# EAGLE design LPC11U24Gadget1 (EAGLE 5.10)
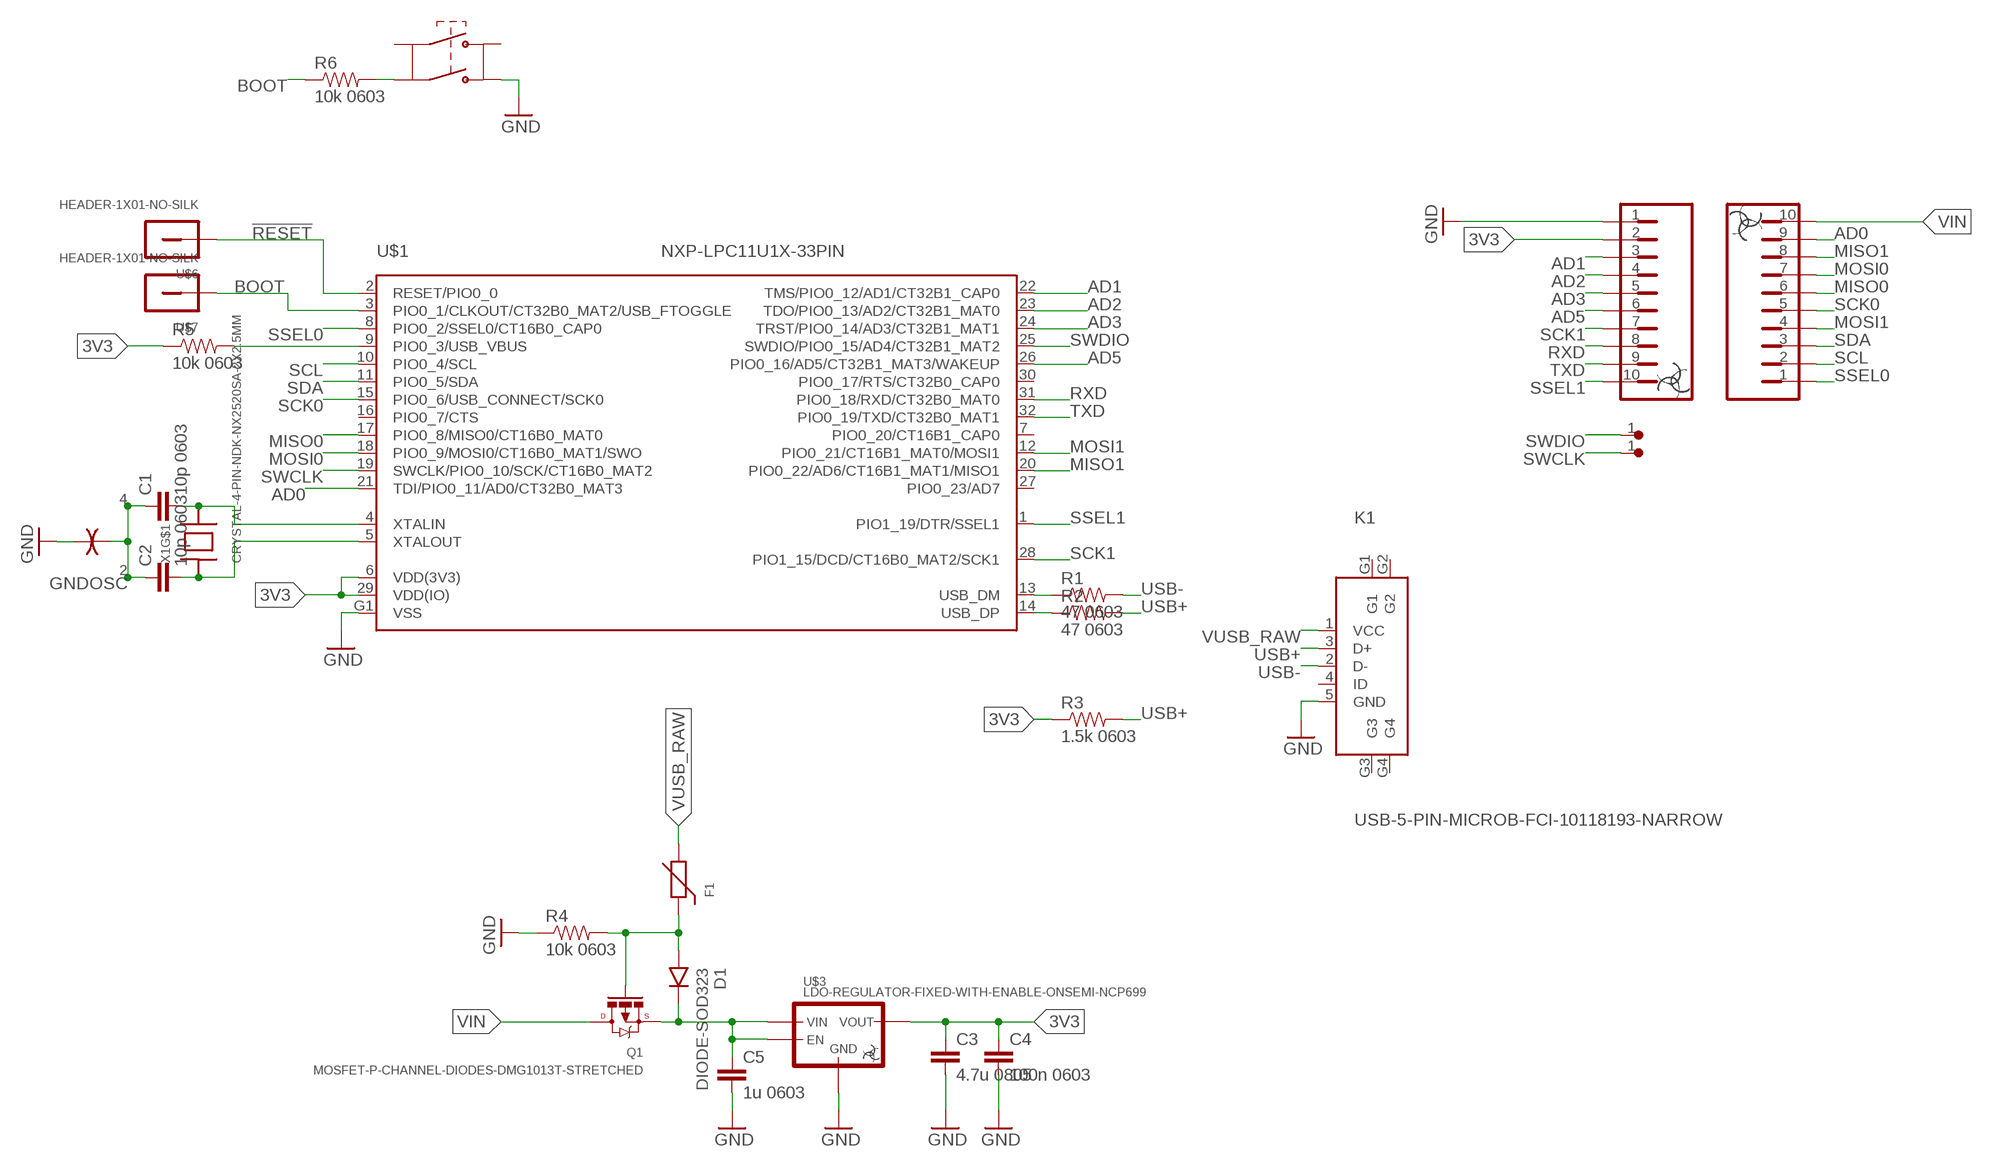
[diagram p0: schematic, sheet 1]

## Parts
C1  10p 0603  CAP-0402-MIN  [0402-MIN]
C2  10p 0603  CAP-0402-MIN  [0402-MIN]
C3  4.7u 0805  CAP-0805  [0805]
C4  100n 0603  CAP-0402-MIN  [0402-MIN]
C5  1u 0603  CAP-0402-MIN  [0402-MIN]
D1  DIODE-SOD323  [SOD323]
F1  PTC-0805-WIDE  [0805-WIDE]
K1  USB-5-PIN-MICROB-FCI-10118193-NARROW  [USB-MICROB-FCI-10118193-NARROW]
K2  HEADER-1X10-NO-SILK  [HEADER-1X10-NO-SILK-CHUNKY]
K3  HEADER-1X10-NO-SILK  [HEADER-1X10-NO-SILK-CHUNKY]
Q1  MOSFET-P-CHANNEL-DIODES-DMG1013T-STRETCHED  [SC-75A-STRETCHED]
R1  47 0603  RESISTOR-0402-MIN  [0402-MIN]
R2  47 0603  RESISTOR-0402-MIN  [0402-MIN]
R3  1.5k 0603  RESISTOR-0402-MIN  [0402-MIN]
R4  10k 0603  RESISTOR-0402-MIN  [0402-MIN]
R5  10k 0603  RESISTOR-0402-MIN  [0402-MIN]
R6  10k 0603  RESISTOR-0402-MIN  [0402-MIN]
SW1  SWITCH-SPST-4-PIN-3.5X3.5MM  [BUTTON-3.5X3.5MM]
U1  GND-ISOLATOR-0.008"  [GND-ISOLATOR-0.008"]
U$1  NXP-LPC11U1X-33PIN  [HVQFN33-5X5MM]
U$3  LDO-REGULATOR-FIXED-WITH-ENABLE-ONSEMI-NCP699  [SOT23-5]
U$4  TEST-POINT-0.75MM  [TEST-POINT-0.75MM]
U$5  TEST-POINT-0.75MM  [TEST-POINT-0.75MM]
U$6  HEADER-1X01-NO-SILK  [HEADER-1X01-NO-SILK]
U$7  HEADER-1X01-NO-SILK  [HEADER-1X01-NO-SILK]
X1  CRYSTAL-4-PIN-NDK-NX2520SA-2X2.5MM  [CRYSTAL-NDK-NX2025SA-2X2.5MM]

## Nets
3V3: C3.2 C4.2 K2.2 R3.1 R5.1 U$1.6(VDD(3V3)) U$1.29(VDD(IO)) U$3.5(VOUT)
!RESET: U$1.2(RESET/PIO0_0) U$6.1
AD0: K3.9 U$1.21(TDI/PIO0_11/AD0/CT32B0_MAT3)
AD1: K2.3 U$1.22(TMS/PIO0_12/AD1/CT32B1_CAP0)
AD2: K2.4 U$1.23(TDO/PIO0_13/AD2/CT32B1_MAT0)
AD3: K2.5 U$1.24(TRST/PIO0_14/AD3/CT32B1_MAT1)
AD5: K2.6 U$1.26(PIO0_16/AD5/CT32B1_MAT3/WAKEUP)
BOOT: R6.1 U$1.3(PIO0_1/CLKOUT/CT32B0_MAT2/USB_FTOGGLE) U$7.1
D+: R2.1 U$1.14(USB_DP)
D-: R1.1 U$1.13(USB_DM)
GND: C3.1 C4.1 C5.1 K1.5(GND) K2.1 R4.1 SW1.3(B2) U1.1(A) U$1.G1(VSS) U$3.2(GND)
GNDOSC: C1.2 C2.2 U1.2(B) X1.2 X1.4
MISO0: K3.6 U$1.17(PIO0_8/MISO0/CT16B0_MAT0)
MISO1: K3.8 U$1.20(PIO0_22/AD6/CT16B1_MAT1/MISO1)
MOSI0: K3.7 U$1.18(PIO0_9/MOSI0/CT16B0_MAT1/SWO)
MOSI1: K3.4 U$1.12(PIO0_21/CT16B1_MAT0/MOSI1)
N$1: C1.1 U$1.4(XTALIN) X1.3
N$2: R6.2 SW1.4(A2)
N$3: C2.1 U$1.5(XTALOUT) X1.1
RXD: K2.8 U$1.31(PIO0_18/RXD/CT32B0_MAT0)
SCK0: K3.5 U$1.15(PIO0_6/USB_CONNECT/SCK0)
SCK1: K2.7 U$1.28(PIO1_15/DCD/CT16B0_MAT2/SCK1)
SCL: K3.2 U$1.10(PIO0_4/SCL)
SDA: K3.3 U$1.11(PIO0_5/SDA)
SSEL0: K3.1 U$1.8(PIO0_2/SSEL0/CT16B0_CAP0)
SSEL1: K2.10 U$1.1(PIO1_19/DTR/SSEL1)
SWCLK: U$1.19(SWCLK/PIO0_10/SCK/CT16B0_MAT2) U$5.1
SWDIO: U$1.25(SWDIO/PIO0_15/AD4/CT32B1_MAT2) U$4.1
TXD: K2.9 U$1.32(PIO0_19/TXD/CT32B0_MAT1)
USB+: K1.3(D+) R2.2 R3.2
USB-: K1.2(D-) R1.2
USB_BOOT: R5.2 U$1.9(PIO0_3/USB_VBUS)
VIN: K3.10 Q1.3(DRAIN)
VSHARE: C5.2 D1.K Q1.2(SOURCE) U$3.1(VIN) U$3.3(EN)
VUSB_FUSED: D1.A F1.2 Q1.1(GATE) R4.2
VUSB_RAW: F1.1 K1.1(VCC)
Unconnected: K1.4(ID) K1.G1 K1.G2 K1.G3 K1.G4 SW1.1(A1) SW1.2(B1) U$1.7(PIO0_20/CT16B1_CAP0) U$1.16(PIO0_7/CTS) U$1.27(PIO0_23/AD7) U$1.30(PIO0_17/RTS/CT32B0_CAP0)

## Library data of the parts
C1-C5 = Outbreak:CAP
D1 = Outbreak:DIODE
F1 = Outbreak:PTC
K1 = Outbreak:USB-5-PIN
K2 K3 = Outbreak:HEADER-1X10-NO-SILK
Q1 = Outbreak:MOSFET-P-CHANNEL
R1-R6 = Outbreak:RESISTOR: Resistor Basic schematic elements and footprints for 0603, 1206, and PTH resistors.
SW1 = Outbreak:SWITCH-SPST-4-PIN
U1 = Outbreak:GND-ISOLATOR
U$1 = Outbreak:NXP-LPC11U1X-33PIN
U$3 = Outbreak:LDO-REGULATOR-FIXED-WITH-ENABLE: Low Drop-Out (LDO) Volt Regulator with enable pin (active at logic high.)
U$4 U$5 = Outbreak:TEST-POINT
U$6 U$7 = Outbreak:HEADER-1X01
X1 = Outbreak:CRYSTAL-4-PIN

## Board
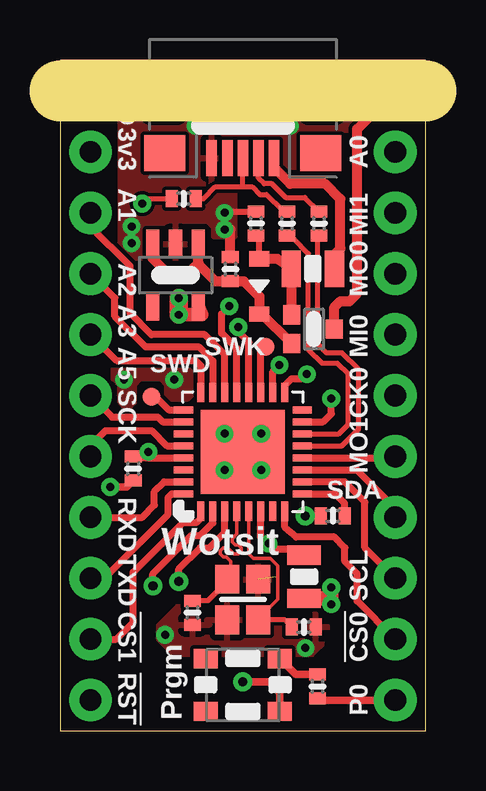
[diagram p1: board, top side]
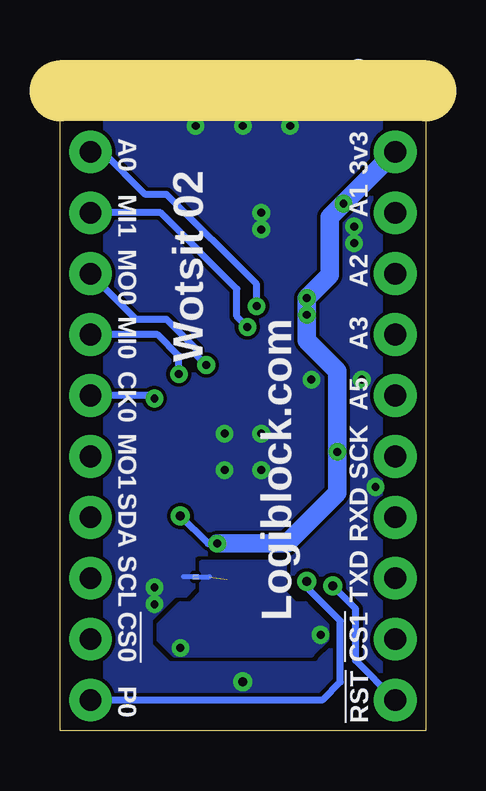
[diagram p2: board, bottom side, seen from below]

Size 15.24 x 27.94 mm. Coordinates in mm from the lower left corner, seen from the top.
Outline: 0,0 15.24,0 15.24,27.94 0,27.94 0,0
Copper layers (1*16): Top 0.035mm / dielectric 1.5mm / Bottom 0.035mm
Design rules "default *": minimum track width 6mil, minimum drill 13mil, track to track 6mil, track to pad 6mil, pad to pad 6mil, via to via 6mil, smd to smd 6mil, copper to edge 10mil, drill to drill 8mil, minimum pad ring 10mil, minimum via ring 8mil, stop-mask expansion 4mil, vias tented up to drill 20mil, thermal gap 10mil
Milling: 1 lines

### Footprints (pad centres in the part's own frame; a part is rotated, then mirrored left to right if it is on the bottom)
0402-MIN = smd 0.5 x 0.7: 1 -0.5,0; 2 0.5,0
0805 = smd 0.8 x 1.397: 1 -0.9,0; 2 0.9,0
SOD323 = smd 0.63 x 0.83: A -1.15,0; K 1.15,0
0805-WIDE = smd 0.8 x 1.524: 1 -0.9,0; 2 0.9,0
USB-MICROB-FCI-10118193-NARROW = smd 0.44 x 1.5: 1 -1.3,2.8; 2 -0.65,2.8; 3 0,2.8; 4 0.65,2.8; 5 1.3,2.8 | smd 1.7 x 1.5: G1 -3.25,2.6; G4 3.25,2.6 | smd 1.8 x 1.8: G2 -1.155,0; G3 1.175,0 | smd 1.72 x 1.72 bottom: G5 -3.3,0; G7 3.3,0 | smd 1.72 x 1.3: G6 -3.3,0.635; G8 3.3,0.635 | drill 1.15 pad 1.7 round: P$1 -3.3,0; P$2 3.3,0
HEADER-1X10-NO-SILK-CHUNKY = drill 0.9 pad 1.778 round: 1 -11.43,0; 2 -8.89,0; 3 -6.35,0; 4 -3.81,0; 5 -1.27,0; 6 1.27,0; 7 3.81,0; 8 6.35,0; 9 8.89,0; 10 11.43,0
SC-75A-STRETCHED = smd 0.8 x 0.7: 1 0.6,0.926; 2 -0.6,0.926; 3 0,-0.851
BUTTON-3.5X3.5MM = smd 1 x 0.8: 1 -1.54,1.1; 2 -1.54,-1.1; 3 1.54,-1.1; 4 1.54,1.1
GND-ISOLATOR-0.008" = smd 0.203 x 0.203: 1 -0.025,0; 2 0.025,0
HVQFN33-5X5MM = smd 0.8 x 0.295: 1 -2.475,1.75; 2 -2.475,1.25; 3 -2.475,0.75; 4 -2.475,0.25; 5 -2.475,-0.25; 6 -2.475,-0.75; 7 -2.475,-1.25; 8 -2.475,-1.75; 17 2.475,-1.75; 18 2.475,-1.25; 19 2.475,-0.75; 20 2.475,-0.25; 21 2.475,0.25; 22 2.475,0.75; 23 2.475,1.25; 24 2.475,1.75 | smd 0.295 x 0.8: 9 -1.75,-2.475; 10 -1.25,-2.475; 11 -0.75,-2.475; 12 -0.25,-2.475; 13 0.25,-2.475; 14 0.75,-2.475; 15 1.25,-2.475; 16 1.75,-2.475; 25 1.75,2.475; 26 1.25,2.475; 27 0.75,2.475; 28 0.25,2.475; 29 -0.25,2.475; 30 -0.75,2.475; 31 -1.25,2.475; 32 -1.75,2.475 | smd 3.5 x 3.5: G1 0,0
SOT23-5 = smd 0.55 x 1.2: 1 0.95,1.3; 2 0,1.3; 3 -0.95,1.3; 4 -0.95,-1.3; 5 0.95,-1.3
TEST-POINT-0.75MM = smd 0.75 x 0.75: 1 0,0
HEADER-1X01-NO-SILK = drill 0.9 pad 1.778 round: 1 0,0
CRYSTAL-NDK-NX2025SA-2X2.5MM = smd 1.2 x 1: 1 -0.85,-0.65; 2 0.85,-0.65; 3 0.85,0.65; 4 -0.85,0.65

### Placement (x,y rotation side)
C1  5.52,4.91 270 top
C2  10.16,4.32 0 top
C3  10.17,6.41 90 top
C4  3.05,10.92 90 top
C5  7.1,19.24 270 top
D1  8.31,18.52 270 top
F1  10.54,19.25 180 top
K1  7.62,26.67 180 top
K2  1.27,15.24 270 top
K3  13.97,15.24 90 top
Q1  10.58,16.74 90 top
R1  10.79,21.15 90 top
R2  9.46,21.15 90 top
R3  5.16,22.17 0 top
R4  8.17,21.15 270 top
R5  11.37,8.95 0 top
R6  10.73,1.84 90 top
SW1  7.62,1.91 0 top
U1  9.59,6.41 0 bottom
U$1  7.62,11.62 90 top
U$3  4.81,18.99 0 top
U$4  3.81,13.92 0 top
U$5  8.57,16 0 top
U$6  1.27,1.27 0 top
U$7  13.97,1.27 0 top
X1  7.62,5.46 90 top

### Tracks (layer width: path | path; a pad name or v marks a point on that pad's centre or on a via)
3V3  (via drill 0.33, 0.38)
  Top 0.203: R3.1 3.63,22.17 v3.43,21.97
  Top 0.292: U$1.6 8.37,8.01 8.57,7.81 | C4.2 3.2,11.37 3.68,11.37 | v8.69,7.8 8.57,7.81 | v3.68,11.62 3.68,11.37 | 3.68,11.37 U$1.29 | 8.57,7.81 8.82,7.57 9.97,7.57 C3.2 | v10.22,8.95 R5.1
  Top 0.559: U$3.5 5.9,17.34 v4.95,17.34
  Top 0.762: v4.95,18.03 v4.95,17.34
  Bottom 0.292: v10.22,8.95 9.07,7.8 v8.69,7.8
  Bottom 0.762: v8.69,7.8 5.79,7.8 3.68,9.91 v3.68,11.62 3.68,14.99 4.95,16.26 v4.95,18.03 | K2.2 v3.43,21.97 4,21.4 4,18.99 v4.95,18.03 | v4.95,18.03 v4.95,17.34
!RESET  (via drill 0.38)
  Top 0.292: U$1.2 6.37,8.66 5.84,8.13 5.46,8.13 3.87,6.54 v3.87,6.03
  Bottom 0.292: v3.87,6.03 2.92,5.08 2.92,2.92 U$6.1
AD0  (via drill 0.33)
  Top 0.292: U$1.21 7.37,15.93 6.73,16.57 6.73,17.37 v7.05,17.69
  Bottom 0.292: v7.05,17.69 7.05,18.61 10.79,22.35 11.68,22.35 13.46,24.13 K3.9
AD1
  Top 0.292: K2.3 1.27,21.02 2.92,19.37 2.92,17.4 3.81,16.51 6.03,16.51 6.87,15.67 U$1.22
AD2
  Top 0.292: U$1.23 6.37,15.41 5.78,16 3.56,16 2.29,17.27 2.29,18.03 K2.4
AD3
  Top 0.292: U$1.24 5.87,15.21 5.65,15.43 2.35,15.43 K2.5
AD5
  Top 0.292: U$1.26 4.27,12.87 4.08,13.07 2.17,13.07 K2.6
BOOT  (via drill 0.38)
  Top 0.292: U$1.3 6.87,8.27 6.22,7.62 5.84,7.62 4.95,6.73 v4.95,6.22
  Top 0.305: R6.1 10.77,1.27 U$7.1
  Bottom 0.292: U$7.1 4.32,1.27 3.56,2.03 3.56,4.57 4.95,5.97 v4.95,6.22
D+
  Top 0.203: U$1.14 11.61,12.37 12,12.76 12,14.86 11.56,15.3 10.92,15.3 10.35,15.88 10.35,19.9 9.72,20.53 R2.1
D-
  Top 0.203: U$1.13 11.74,11.87 12.45,12.57 12.45,15.05 11.75,15.75 11.11,15.75 10.73,16.13 10.73,20.54 R1.1
GND  (via drill 0.33, 0.38)
  Top 0.254: R4.1 6.86,21.64 v6.86,21.59
  Top 0.292: v6.86,10.86 U$1.G1
  Top 0.305: SW1.3 9.16,1.57 8.7,2.03 v7.62,2.03 | C4.1 2.79,10.16 v2.1,10.16
  Top 0.406: v6.86,20.89 7.1,20.89 C5.1
  Top 0.457: K2.1 2.79,26.67
  Top 0.61: C3.1 11.3,5.51 | 11.3,5.51 v11.3,5.97 | 11.3,5.51 v11.3,5.27
  Bottom 0.203: U1.1 10.1,6.41
  other vias: 5.65,25.21 7.62,25.21 2.98,20.32 2.98,21.02 6.86,12.38 8.38,10.86 8.38,12.38 9.59,25.21 4.76,14.63 2.67,14.63
  pour Top (rank 2): 2.54,26.8 12.76,26.8 12.76,23.5 7.26,23.47 7.26,20.6 6.43,20.6 6.43,20.95 6.15,21.23 5.17,21.23 5.17,19.7 2.54,19.68
  pour Bottom (rank 2): 1.91,26.8 13.34,26.8 13.34,1.08 1.91,1.08
  pour Top: 2.24,15.09 5.31,15.09 5.45,14.95 5.45,13.97 5.31,13.83 4.61,13.83 4.47,13.97 4.47,14.39 4.19,14.67 3.35,14.67 3.07,14.39 3.07,13.69 2.93,13.55 2.65,13.55 2.51,13.69 2.51,14.39 2.24,14.67
GNDOSC  (via drill 0.33)  (1 unrouted)
  Bottom 0.203: U1.2 9.02,6.41
  other vias: 4.38,3.99 10.22,3.44
  pour Top: 5.91,7.3 9.33,7.3 9.33,5.71 9.78,5.27 10.22,5.27 11.11,4.38 11.11,3.81 10.48,3.17 4.76,3.17 4.13,3.81 4.13,4.38 5.02,5.27 5.46,5.27 5.91,5.71
  pour Bottom: 5.91,6.99 9.33,6.99 9.33,5.71 9.78,5.27 10.22,5.27 11.11,4.38 11.11,3.81 10.48,3.17 4.76,3.17 4.13,3.81 4.13,4.38 5.02,5.27 5.46,5.27 5.91,5.71
MISO0  (via drill 0.33)
  Top 0.292: U$1.17 9.37,14.39 9.65,14.67 10.03,14.67 10.22,14.86 v10.29,14.86
  Bottom 0.292: v10.29,14.86 10.29,15.62 11.18,16.51 K3.6
MISO1  (via drill 0.33)
  Top 0.292: U$1.20 7.87,16.2 7.43,16.64 v7.43,16.83
  Bottom 0.292: K3.8 11.05,21.59 7.87,18.41 7.87,17.27 v7.43,16.83
MOSI0  (via drill 0.33)
  Top 0.292: U$1.18 8.87,14.97 v9.14,15.24
  Bottom 0.292: v9.14,15.24 9.53,15.62 9.53,15.88 10.79,17.14 12.06,17.14 K3.7
MOSI1
  Top 0.292: U$1.12 13.9,11.37 K3.4
N$1
  Top 0.152: U$1.4 7.37,8.2 7.18,8 7.18,7.87 7.3,7.75 7.43,7.75 7.56,7.62 7.56,7.49 7.43,7.37 7.24,7.37 6.99,7.62 6.79,7.62 6.67,7.49 6.67,7.37 6.79,7.24 6.92,7.24 7.11,7.05 7.11,6.38 X1.3
  Top 0.203: C1.1 6.16,5.42 6.97,6.22 X1.3
N$2
  Top 0.305: SW1.4 9.82,2.34 R6.2
N$3
  Top 0.152: U$1.5 7.87,7.36 8.06,7.18 8.76,7.18 9.08,6.86 9.08,5.46 8.29,4.67 X1.1
  Top 0.203: C2.1 9.38,4.61 X1.1
RXD
  Top 0.292: U$1.31 4.34,10.37 3.94,9.97 3.94,9.4 3.43,8.89 K2.8
SCK0  (via drill 0.33)
  Top 0.292: v11.3,13.84 11.3,13.21 10.97,12.87 U$1.15
  Bottom 0.292: v11.3,13.84 11.43,13.97 K3.5
SCK1
  Top 0.292: K2.7 1.27,11.87 1.9,12.51 3.81,12.51 4.45,11.87 U$1.28
SCL
  Top 0.292: U$1.10 11.85,10.37 12.7,9.53 12.7,7.62 K3.2
SDA
  Top 0.292: U$1.11 12.37,10.87 13.97,9.27 K3.3
SSEL0
  Top 0.292: U$1.8 9.37,8.47 9.84,8.06 11.43,8.06 11.87,7.62 11.87,7.05 12.38,6.54 12.38,5.4 K3.1
SSEL1
  Top 0.292: U$1.1 5.87,8.85 5.7,8.69 5.13,8.69 3.05,6.6 3.05,4.51 2.35,3.81 K2.10
SWCLK
  Top 0.292: U$1.19 8.37,15.8 U$5.1
SWDIO
  Top 0.292: U$1.25 4.52,13.37 3.98,13.92 U$4.1
TXD
  Top 0.292: U$1.32 4.66,9.87 4.51,9.72 4.51,9.02 1.84,6.35 K2.9
USB+
  Top 0.203: 7.62,22.67 K1.3 | 7.62,22.67 6.48,22.67 5.98,22.17 R3.2 | 7.62,22.67 8,22.67 8.32,22.35 8.61,22.35 9.28,21.69 R2.2
USB-
  Top 0.203: K1.2 8.27,23.04 8.51,22.8 8.83,22.8 9.4,22.23 10.2,22.23 R1.2
USB_BOOT
  Top 0.292: U$1.9 11.47,9.87 11.85,9.48 R5.2
VIN
  Top 0.406: Q1.3 11.43,17.65 11.68,17.91 12.06,17.91 12.38,18.22 12.38,25.08 K3.10
VSHARE
  Top 0.406: Q1.2 9.5,16.28 8.48,17.3 D1.K 8.31,18.1 7.66,18.74 C5.2 6.47,18.74 5.76,19.45 5.76,19.5 | 5.76,19.5 U$3.1 | U$3.3 3.86,19.68 4.37,19.18 5.44,19.18 5.76,19.5
VUSB_FUSED
  Top 0.254: R4.2 8.31,20.64 D1.A
  Top 0.406: Q1.1 9.65,19.24 F1.2 9.07,19.67 D1.A
VUSB_RAW
  Top 0.406: K1.1 8.92,23.46 9.59,22.8 11.05,22.8 11.68,22.16 11.68,20.1 11.44,19.86 F1.1

### Text on the board
tPlace: GND | VIN | 3v3 | A1 | A0 | MI1 | A2 | A3 | MO0 | A5 | SWK | MI0 | SWD | SCK | CK0 | MO1 | RXD | SDA | TXD | Wotsit | !CS1 | SCL | !CS0 | !RST | P0 | Prgm
bPlace: VIN | GND | A0 | 3v3 | MI1 | A1 | MO0 | A2 | MI0 | A3 | Wotsit 02 | CK0 | A5 | MO1 | SCK | SDA | RXD | SCL | TXD | Logiblock.com | !CS0 | !CS1 | P0 | !RST